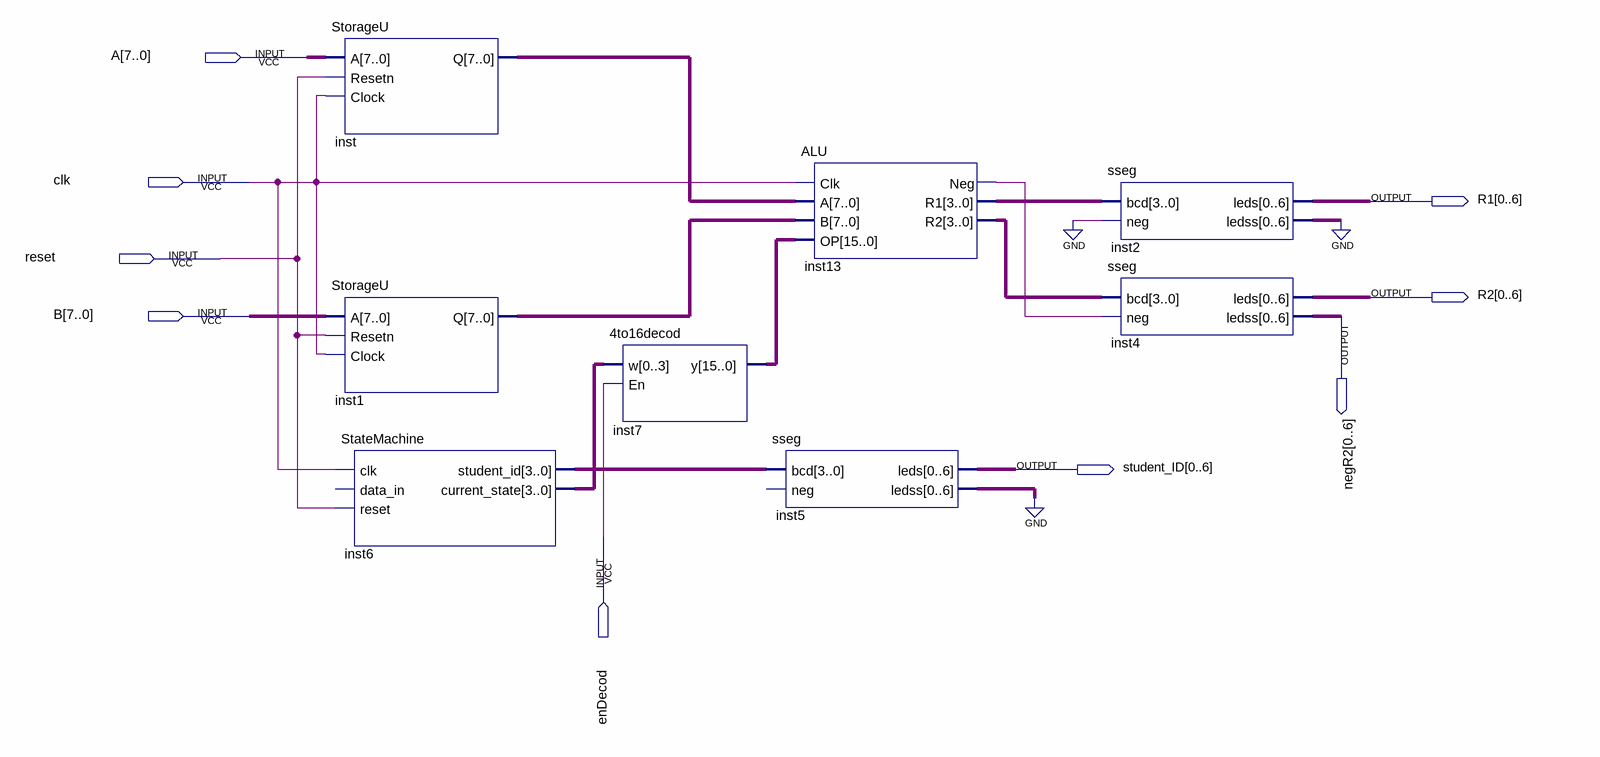
[diagram p0: schematic sheet]
// Quartus schematic GPUblock.bdf as structural Verilog: 8 symbols, 9 pins
module GPUblock (
  input  [7:0] A,
  input  clk,
  input  reset,
  input  [7:0] B,
  input  enDecod,
  output [0:6] R1,
  output [0:6] R2,
  output [0:6] negR2,
  output [0:6] student_ID
);

  wire inst13_neg;
  wire [3:0] inst6_current_state, inst6_student_id, inst13_r1, inst13_r2;
  wire [6:0] inst2_ledss, inst5_ledss;
  wire [7:0] inst1_q, inst_q;
  wire [15:0] inst7_y;

  StorageU inst (.A(A), .Resetn(reset), .Clock(clk), .Q(inst_q));
  StorageU inst1 (.A(B), .Resetn(reset), .Clock(clk), .Q(inst1_q));
  StateMachine inst6 (
    .clk(clk), .reset(reset), .student_id(inst6_student_id), .current_state(inst6_current_state));  // open: data_in
  \4to16decod  inst7 (.w(inst6_current_state), .En(enDecod), .y(inst7_y));
  sseg inst5 (.bcd(inst6_student_id), .leds(student_ID), .ledss(inst5_ledss));  // open: neg
  ALU inst13 (.Clk(clk), .A(inst_q), .B(inst1_q), .OP(inst7_y), .Neg(inst13_neg), .R1(inst13_r1), .R2(inst13_r2));
  sseg inst2 (.bcd(inst13_r1), .neg(1'b0), .leds(R1), .ledss(inst2_ledss));
  sseg inst4 (.bcd(inst13_r2), .neg(inst13_neg), .leds(R2), .ledss(negR2));
  // also tied to GND on the sheet: {inst2_ledss[0], inst2_ledss[1], inst2_ledss[2], inst2_ledss[3], inst2_ledss[4], inst2_ledss[5], inst2_ledss[6], inst5_ledss[0], inst5_ledss[1], inst5_ledss[2], inst5_ledss[3], inst5_ledss[4], inst5_ledss[5], inst5_ledss[6]}
endmodule
